# EAGLE design light (EAGLE 4.16)
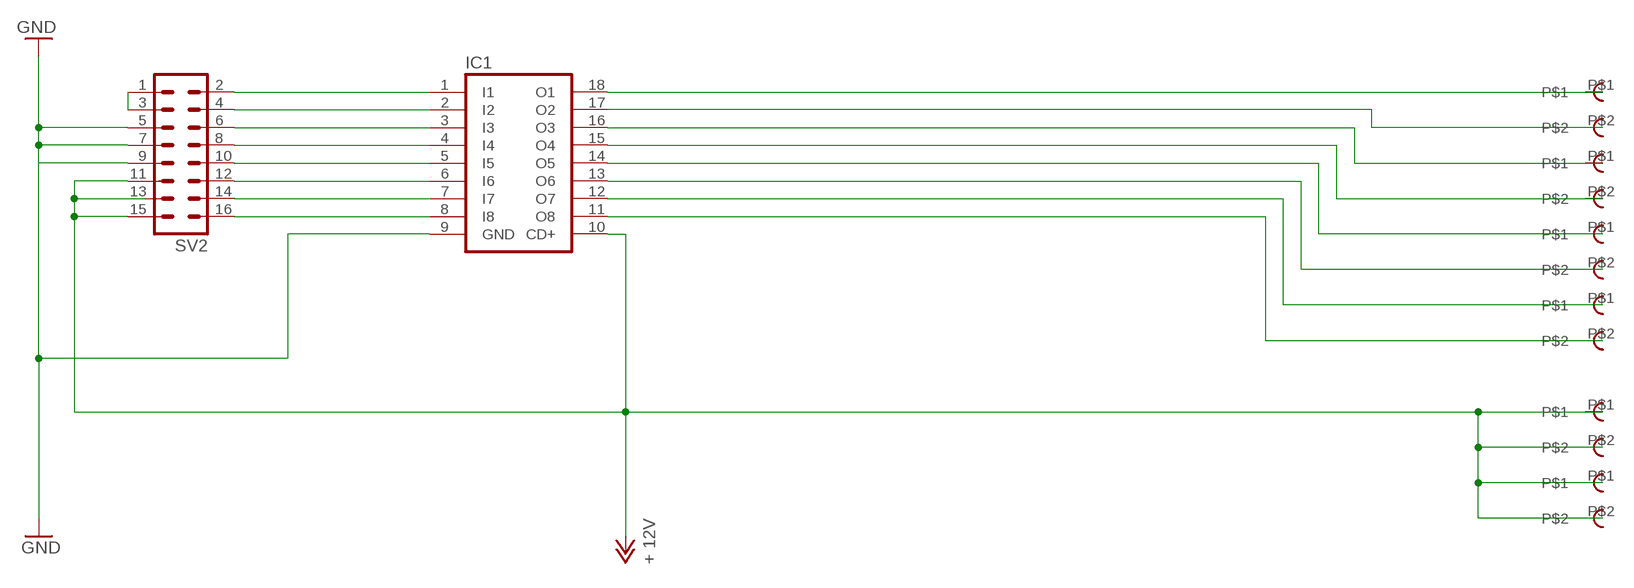
[diagram p0: schematic, sheet 1]

## Parts
IC1  ULN2803A  [DIL18]
SV2  ML16  [ML16]
U$1  RIACON101-2  [RIACON101-2]
U$2  RIACON101-2  [RIACON101-2]
U$3  RIACON101-2  [RIACON101-2]
U$4  RIACON101-2  [RIACON101-2]
U$7  RIACON101-2  [RIACON101-2]
U$8  RIACON101-2  [RIACON101-2]

## Nets
+18V: IC1.10(CD+) SV2.11 SV2.15 U$7.P$1 U$7.P$2 U$8.P$1 U$8.P$2 ; supply symbol labelled + 12V
GND: IC1.9(GND) SV2.5 SV2.7 SV2.9
N$1: IC1.1(I1) SV2.2
N$2: IC1.2(I2) SV2.4
N$3: IC1.3(I3) SV2.6
N$4: IC1.4(I4) SV2.8
N$5: IC1.5(I5) SV2.10
N$6: IC1.18(O1) U$1.P$1
N$7: IC1.6(I6) SV2.12
N$8: IC1.7(I7) SV2.14
N$9: IC1.8(I8) SV2.16
N$10: IC1.17(O2) U$1.P$2
N$11: IC1.16(O3) U$2.P$1
N$12: IC1.15(O4) U$2.P$2
N$13: IC1.14(O5) U$3.P$1
N$14: IC1.13(O6) U$3.P$2
N$15: IC1.12(O7) U$4.P$1
N$16: SV2.1 SV2.3
N$17: IC1.11(O8) U$4.P$2
Unconnected: SV2.13

## Library data of the parts
IC1 = uln-udn:ULN2803A: DRIVER ARRAY
SV2 = con-harting-ml:ML16: HARTING
U$1-U$4 U$7 U$8 = con-riacon101:RIACON101-2: Riaconn Schreaubklemme 101

## Board
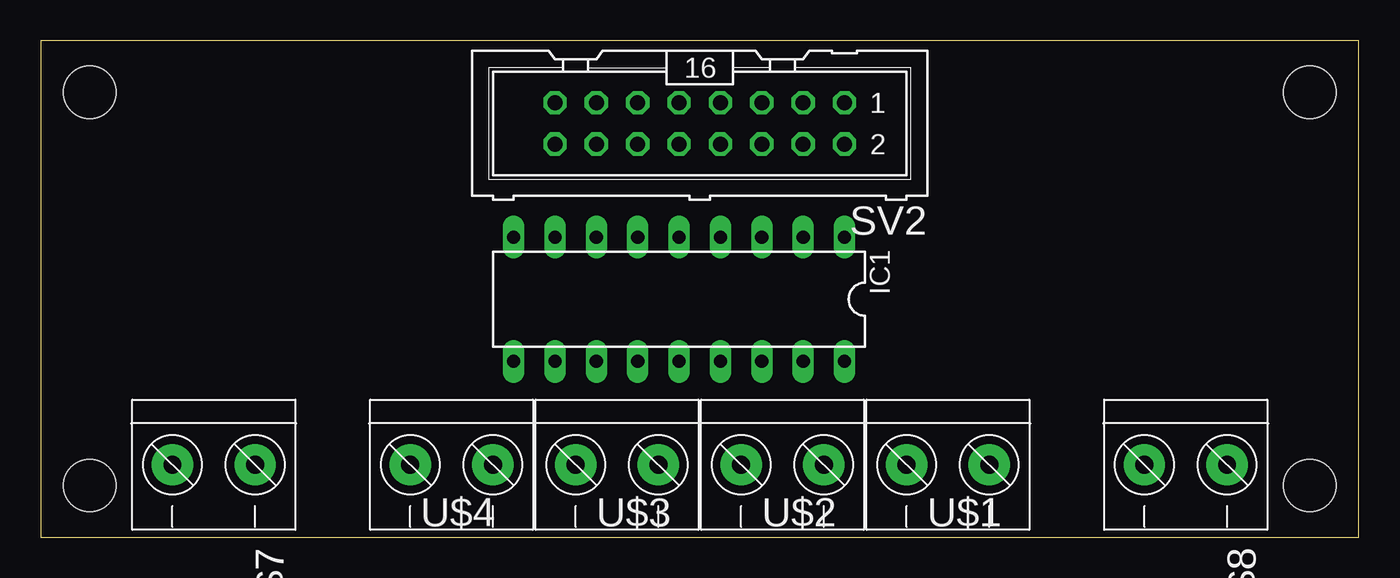
[diagram p1: board, top side]
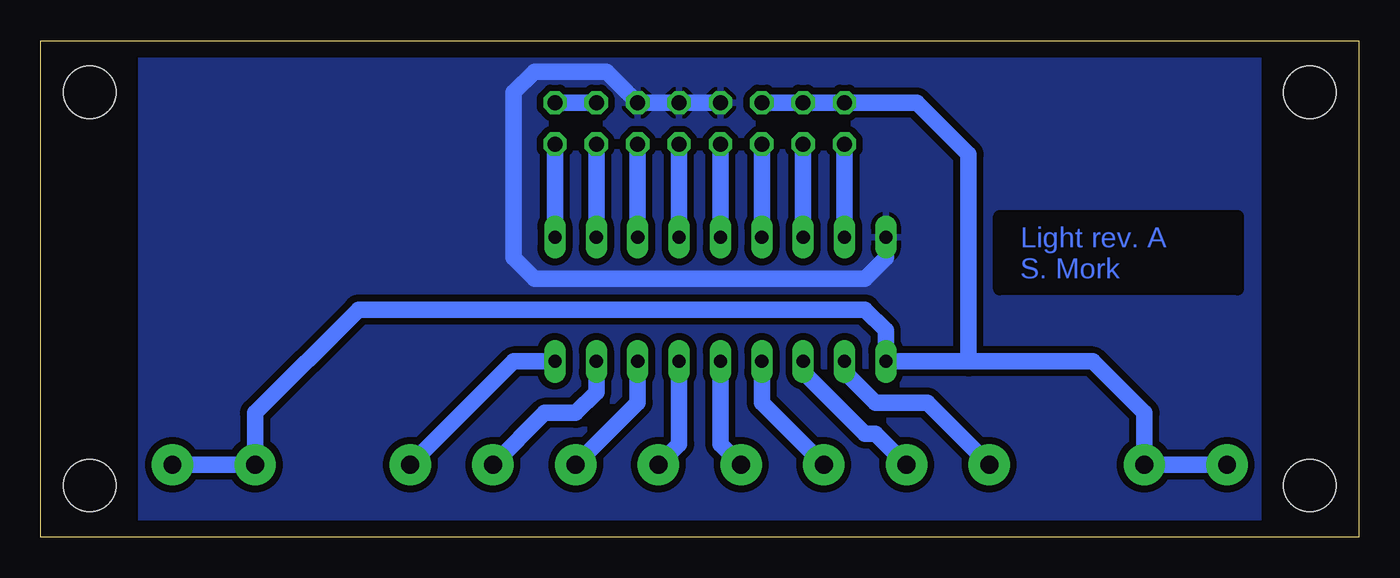
[diagram p2: board, bottom side, seen from below]

Size 80.95 x 30.47 mm. Coordinates in mm from the lower left corner, seen from the top.
Outline: 0,0 80.95,0 80.95,30.47 0,30.47 0,0
Copper layers (1*16): Top 0.035mm / dielectric 1.5mm / Bottom 0.035mm
Design rules "default": minimum track width 10mil, minimum drill 24mil, track to track 8mil, track to pad 8mil, pad to pad 8mil, via to via 8mil, smd to smd 8mil, copper to edge 40mil, drill to drill 8mil, minimum pad ring 10mil, minimum via ring 8mil, stop-mask expansion 4mil, vias tented up to drill 0mil, thermal gap 10mil
Holes 3.2 mm at 3.01,27.3 3.01,3.17 77.94,3.17 77.94,27.3
tRestrict: area 75.4,0 to 80.5,30.5; area 0.5,0 to 5.5,30.5
bRestrict: area 7.5,15.2 to 22.1,19.7

### Footprints (pad centres in the part's own frame; a part is rotated, then mirrored left to right if it is on the bottom)
DIL18 = drill 0.813 long: 1 -10.16,-3.81; 2 -7.62,-3.81; 3 -5.08,-3.81; 4 -2.54,-3.81; 5 0,-3.81; 6 2.54,-3.81; 7 5.08,-3.81; 8 7.62,-3.81; 9 10.16,-3.81; 10 10.16,3.81; 11 7.62,3.81; 12 5.08,3.81; 13 2.54,3.81; 14 0,3.81; 15 -2.54,3.81; 16 -5.08,3.81; 17 -7.62,3.81; 18 -10.16,3.81
ML16 = drill 0.914 octagon: 1 -8.89,-1.27; 2 -8.89,1.27; 3 -6.35,-1.27; 4 -6.35,1.27; 5 -3.81,-1.27; 6 -3.81,1.27; 7 -1.27,-1.27; 8 -1.27,1.27; 9 1.27,-1.27; 10 1.27,1.27; 11 3.81,-1.27; 12 3.81,1.27; 13 6.35,-1.27; 14 6.35,1.27; 15 8.89,-1.27; 16 8.89,1.27
RIACON101-2 = drill 1.1 pad 2.54 round: P$1 0,2.54; P$2 0,-2.54

### Placement (x,y rotation side)
IC1  39.2,14.6 180 top
SV2  40.48,25.39 180 top
U$1  55.71,4.44 270 top
U$2  45.55,4.44 270 top
U$3  35.39,4.44 270 top
U$4  25.23,4.44 270 top
U$7  10.63,4.44 270 top
U$8  70.32,4.44 270 top

### Tracks (layer width: path | path; a pad name or v marks a point on that pad's centre or on a via)
+18V
  Bottom 1.016: 23.96,10.79 IC1.10 29.04,12.7 30.31,13.96 61.43,13.96 67.78,7.62 U$8.P$2 U$8.P$1 | 23.96,10.79 16.34,10.79 13.17,7.62 U$7.P$1 U$7.P$2 | SV2.11 SV2.15 27.14,26.67 23.96,23.49 23.96,10.79
GND
  Bottom 1.016: SV2.9 SV2.7 SV2.5 46.19,28.57 50.63,28.57 51.91,27.3 51.91,17.14 50.63,15.87 30.31,15.87 29.04,17.14 IC1.9
  pour Bottom (isolate 0.406): 6.18,29.84 74.77,29.84 74.77,0.63 6.18,0.63
N$1
  Bottom 1.016: IC1.1 SV2.2
N$2
  Bottom 1.016: IC1.2 SV2.4
N$3
  Bottom 1.016: IC1.3 SV2.6
N$4
  Bottom 1.016: IC1.4 SV2.8
N$5
  Bottom 1.016: IC1.5 SV2.10
N$6
  Bottom 1.016: IC1.18 51.91,10.79 U$1.P$1
N$7
  Bottom 1.016: SV2.12 IC1.6
N$8
  Bottom 1.016: SV2.14 IC1.7
N$9
  Bottom 1.016: SV2.16 IC1.8
N$10
  Bottom 1.016: IC1.17 46.82,8.89 48.09,7.62 50,7.62 U$1.P$2
N$11
  Bottom 1.016: IC1.16 44.28,8.25 U$2.P$1
N$12
  Bottom 1.016: IC1.15 41.74,5.71 U$2.P$2
N$13
  Bottom 1.016: IC1.14 39.2,5.71 U$3.P$1
N$14
  Bottom 1.016: IC1.13 36.66,8.25 U$3.P$2
N$15
  Bottom 1.016: IC1.12 34.12,10.16 30.31,6.35 29.68,6.35 U$4.P$1
N$16
  Bottom 1.016: SV2.3 SV2.1
N$17
  Bottom 1.016: IC1.11 31.58,10.16 29.68,8.25 26.5,8.25 U$4.P$2

### Text on the board
Bottom: Light rev. A | S. Mork